# Altium schematic sheet Sheet1.SchDoc
size A3; SheetNumber: 1; SheetTotal: 1
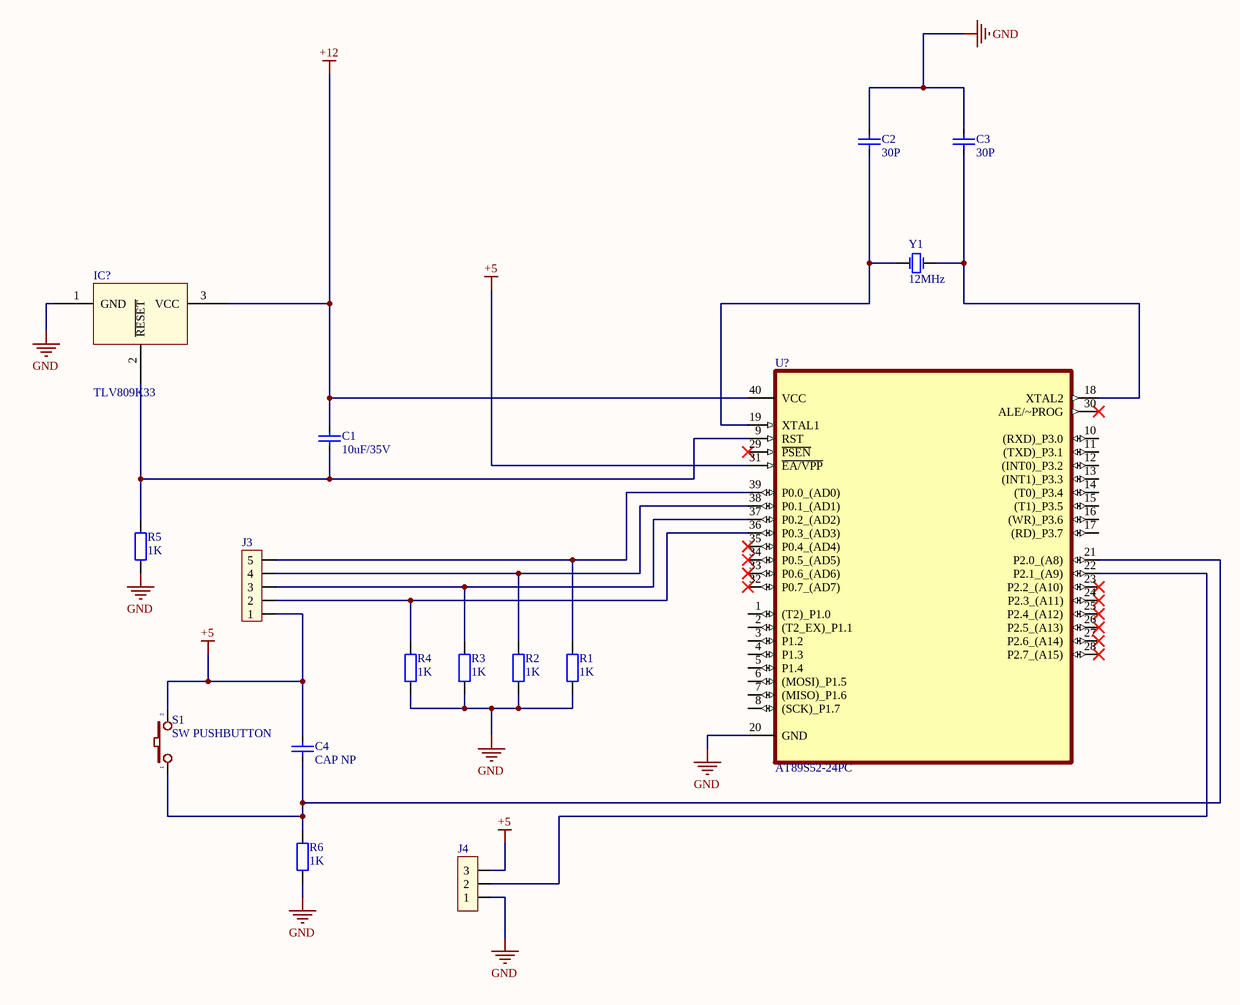
[diagram p0: Sheet1.SchDoc]

## Parts
C1  10uF/35V  [CAP_0402]
C2  30P  [CAP_0402]
C3  30P  [CAP_0402]
C4  CAP NP  [CAP_0402]
IC?  TLV809K33  [SOT23]
J3  (no value)  [JP5]
J4  (no value)  [JP3]
R1  1K  [RES-SMD-0101]
R2  1K  [RES-SMD-0101]
R3  1K  [RES-SMD-0101]
R4  1K  [RES-SMD-0101]
R5  1K  [RES-SMD-0101]
R6  1K  [RES-SMD-0101]
S1  SW PUSHBUTTON  [SW2]
U?  AT89S52-24PC  [DIP254P1524X482-40]
Y1  12MHz  [XTAL]

## Nets
+5: C4.2 J3.1 J4.3 S1.2 U?.31(~{EA/VPP})
+12: C1.2 IC?.3(VCC) U?.40(VCC)
GND: C2.2 C3.2 IC?.1(GND) J4.1 R1.2 R2.2 R3.2 R4.2 R5.2 R6.2 U?.20(GND)
NetC1_1: C1.1 IC?.2(~{RESET}) R5.1 U?.9(RST)
NetC2_1: C2.1 U?.19(XTAL1) Y1.1(OSC1)
NetC3_1: C3.1 U?.18(XTAL2) Y1.2(OSC2)
NetC4_1: C4.1 R6.1 S1.1 U?.21(P2.0_(A8))
NetJ3_2: J3.2 R4.1 U?.36(P0.3_(AD3))
NetJ3_3: J3.3 R3.1 U?.37(P0.2_(AD2))
NetJ3_4: J3.4 R2.1 U?.38(P0.1_(AD1))
NetJ3_5: J3.5 R1.1 U?.39(P0.0_(AD0))
NetJ4_2: J4.2 U?.22(P2.1_(A9))

Not connected (* = marked no-connect by the designer): U? 1((T2)_P1.0) 2((T2_EX)_P1.1) 3(P1.2) 4(P1.3) 5(P1.4) 6((MOSI)_P1.5) 7((MISO)_P1.6) 8((SCK)_P1.7) 10((RXD)_P3.0) 11((TXD)_P3.1) 12((INT0)_P3.2) 13((INT1)_P3.3) 14((T0)_P3.4) 15((T1)_P3.5) 16((WR)_P3.6) 17((RD)_P3.7) 23(P2.2_(A10))* 24(P2.3_(A11))* 25(P2.4_(A12))* 26(P2.5_(A13))* 27(P2.6_(A14))* 28(P2.7_(A15))* 29(~{PSEN})* 30(ALE/~PROG)* 32(P0.7_(AD7))* 33(P0.6_(AD6))* 34(P0.5_(AD5))* 35(P0.4_(AD4))*

## Library data of the parts
C1-C4 = CapSMD: Capacitor; Value: 33p; Published: 8-Jun-2000; LatestRevisionDate: 17-Jul-2002; LatestRevisionNote: Re-released for DXP Platform.; PackageReference: RAD-0.3; Publisher: Altium Limited
IC? = TLV809K33: Reset IC, Supply Voltage Supervisors
J3 = JP5_2
J4 = JP3: Jumper 3; Value: J3
R1-R6 = Resistor - SMD: Resistor SMD; Manufacturer: Generic Components; Class: Passive; Published: 08/06/2000; Publisher: Altium Hobart Technology Centre
S1 = SW2: Switch button 2 pin; Value: SW chip 2 pin
U? = AT89S52-24PC: 8051 series Microcontroller IC 8-Bit 24MHz 8KB (8K x 8) FLASH 40-PDIP; MF: Microchip; Check_prices: https://www.snapeda.com/parts/AT89S52-24PC/Microchip/view-part/?ref=eda; Value: *; Availability: In Stock; MP: AT89S52-24PC; Price: None; Package: DIP-40 Microchip; SnapEDA_Link: https://www.snapeda.com/parts/AT89S52-24PC/Microchip/view-part/?ref=snap; Purchase-URL: https://pricing.snapeda.com/search/part/AT89S52-24PC/?ref=eda
Y1 = XTAL: Crystal Oscillator; Published: 8-Jun-2000; LatestRevisionDate: 17-Jul-2002; LatestRevisionNote: Re-released for DXP Platform.; PackageReference: R38; Publisher: Altium Limited